# EAGLE schematic DeviceDIn24 (EAGLE 5.00)
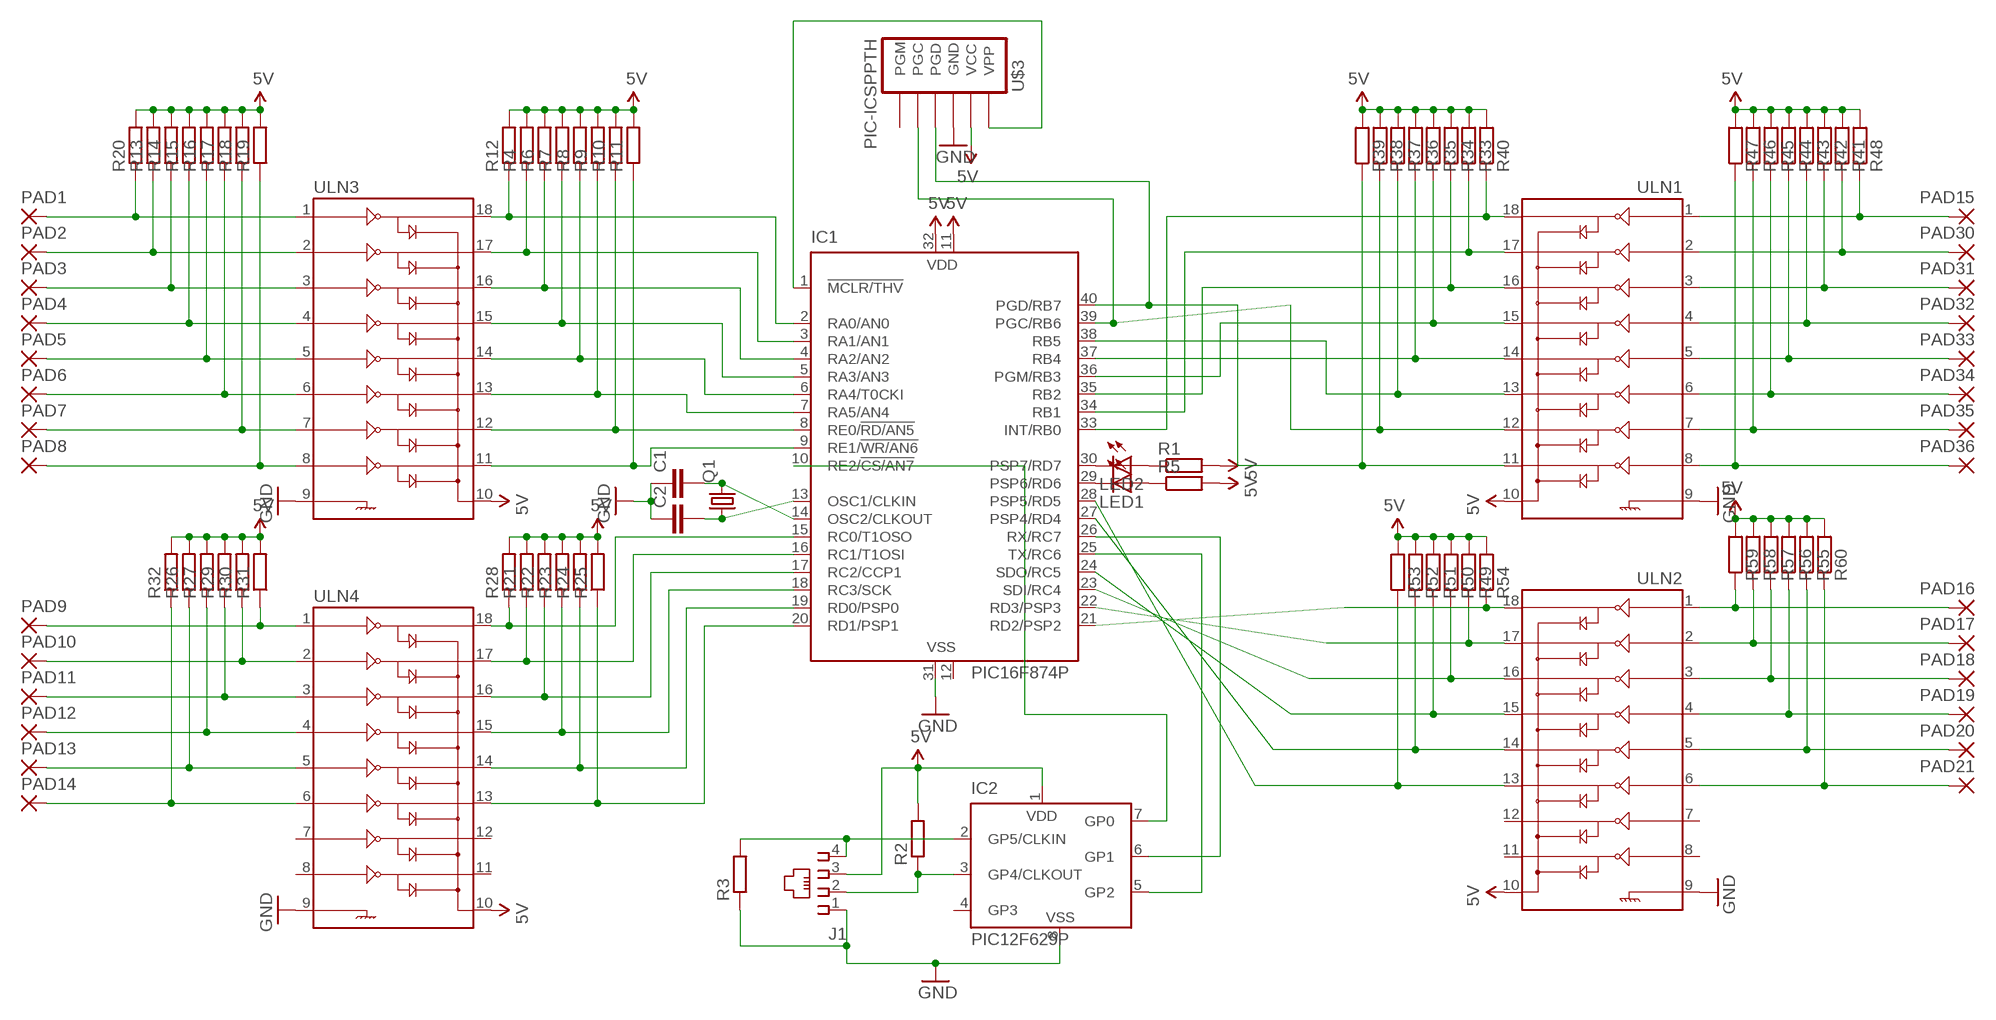
[diagram p0: schematic, sheet 1]

## Parts
C1  C2.5/2  [C2.5-2]
C2  C2.5/2  [C2.5-2]
IC1  PIC16F874P  [DIL40]
IC2  PIC12F629P  [DIL8]
J1  215876-6  [215876-6]
LED1  LED3MM  [LED3MM]
LED2  LED3MM  [LED3MM]
PAD1  2,15/1,0  [2,15/1,0]
PAD2  2,15/1,0  [2,15/1,0]
PAD3  2,15/1,0  [2,15/1,0]
PAD4  2,15/1,0  [2,15/1,0]
PAD5  2,15/1,0  [2,15/1,0]
PAD6  2,15/1,0  [2,15/1,0]
PAD7  2,15/1,0  [2,15/1,0]
PAD8  2,15/1,0  [2,15/1,0]
PAD9  2,15/1,0  [2,15/1,0]
PAD10  2,15/1,0  [2,15/1,0]
PAD11  2,15/1,0  [2,15/1,0]
PAD12  2,15/1,0  [2,15/1,0]
PAD13  2,15/1,0  [2,15/1,0]
PAD14  2,15/1,0  [2,15/1,0]
PAD15  2,15/1,0  [2,15/1,0]
PAD16  2,15/1,0  [2,15/1,0]
PAD17  2,15/1,0  [2,15/1,0]
PAD18  2,15/1,0  [2,15/1,0]
PAD19  2,15/1,0  [2,15/1,0]
PAD20  2,15/1,0  [2,15/1,0]
PAD21  2,15/1,0  [2,15/1,0]
PAD30  2,15/1,0  [2,15/1,0]
PAD31  2,15/1,0  [2,15/1,0]
PAD32  2,15/1,0  [2,15/1,0]
PAD33  2,15/1,0  [2,15/1,0]
PAD34  2,15/1,0  [2,15/1,0]
PAD35  2,15/1,0  [2,15/1,0]
PAD36  2,15/1,0  [2,15/1,0]
Q1  CRYSTALHC49U-H  [HC49U-H]
R1  R-EU_0204/2V  [0204V]
R2  R-EU_0204/5  [0204/5]
R3  R-EU_0204/5  [0204/5]
R4  R-EU_0204/5  [0204/5]
R5  R-EU_0204/2V  [0204V]
R6  R-EU_0204/7  [0204/7]
R7  R-EU_0207/10  [0207/10]
R8  R-EU_0207/10  [0207/10]
R9  R-EU_0204/7  [0204/7]
R10  R-EU_0204/5  [0204/5]
R11  R-EU_0204/5  [0204/5]
R12  R-EU_0204/5  [0204/5]
R13  R-EU_0204/5  [0204/5]
R14  R-EU_0204/7  [0204/7]
R15  R-EU_0207/10  [0207/10]
R16  R-EU_0207/10  [0207/10]
R17  R-EU_0204/7  [0204/7]
R18  R-EU_0204/5  [0204/5]
R19  R-EU_0204/5  [0204/5]
R20  R-EU_0204/5  [0204/5]
R21  R-EU_0204/5  [0204/5]
R22  R-EU_0204/7  [0204/7]
R23  R-EU_0204/7  [0204/7]
R24  R-EU_0204/5  [0204/5]
R25  R-EU_0204/5  [0204/5]
R26  R-EU_0204/5  [0204/5]
R27  R-EU_0204/7  [0204/7]
R28  R-EU_0204/5  [0204/5]
R29  R-EU_0204/7  [0204/7]
R30  R-EU_0204/5  [0204/5]
R31  R-EU_0204/5  [0204/5]
R32  R-EU_0204/5  [0204/5]
R33  R-EU_0204/5  [0204/5]
R34  R-EU_0204/7  [0204/7]
R35  R-EU_0207/10  [0207/10]
R36  R-EU_0207/10  [0207/10]
R37  R-EU_0204/7  [0204/7]
R38  R-EU_0204/5  [0204/5]
R39  R-EU_0204/5  [0204/5]
R40  R-EU_0204/5  [0204/5]
R41  R-EU_0204/5  [0204/5]
R42  R-EU_0204/7  [0204/7]
R43  R-EU_0207/10  [0207/10]
R44  R-EU_0207/10  [0207/10]
R45  R-EU_0204/7  [0204/7]
R46  R-EU_0204/5  [0204/5]
R47  R-EU_0204/5  [0204/5]
R48  R-EU_0204/5  [0204/5]
R49  R-EU_0204/5  [0204/5]
R50  R-EU_0204/7  [0204/7]
R51  R-EU_0204/7  [0204/7]
R52  R-EU_0204/5  [0204/5]
R53  R-EU_0204/5  [0204/5]
R54  R-EU_0204/5  [0204/5]
R55  R-EU_0204/5  [0204/5]
R56  R-EU_0204/7  [0204/7]
R57  R-EU_0204/7  [0204/7]
R58  R-EU_0204/5  [0204/5]
R59  R-EU_0204/5  [0204/5]
R60  R-EU_0204/5  [0204/5]
U$3  PIC-ICSPPTH  [MOLEX-1X6]
ULN1  ULN2803DIP  [DIL18]
ULN2  ULN2803DIP  [DIL18]
ULN3  ULN2803DIP  [DIL18]
ULN4  ULN2803DIP  [DIL18]

## Nets
5V: IC1.11(VDD) IC1.32(VDD) IC2.1(VDD) J1.3 R1.2 R2.2 R4.2 R5.2 R6.2 R7.2 R8.2 R9.2 R10.2 R11.2 R12.2 R13.2 R14.2 R15.2 R16.2 R17.2 R18.2 R19.2 R20.2 R21.2 R22.2 R23.2 R24.2 R25.2 R26.2 R27.2 R28.2 R29.2 R30.2 R31.2 R32.2 R33.2 R34.2 R35.2 R36.2 R37.2 R38.2 R39.2 R40.2 R41.2 R42.2 R43.2 R44.2 R45.2 R46.2 R47.2 R48.2 R49.2 R50.2 R51.2 R52.2 R53.2 R54.2 R55.2 R56.2 R57.2 R58.2 R59.2 R60.2 U$3.5(VCC) ULN1.10 ULN2.10 ULN3.10 ULN4.10
GND: C1.1 C2.1 IC1.31(VSS) IC2.8(VSS) J1.1 R3.1 U$3.4(GND) ULN1.9 ULN2.9 ULN3.9 ULN4.9
N$1: IC1.1(!MCLR/THV) U$3.6(VPP)
N$2: IC1.21(RD2/PSP2) R54.1 ULN2.18
N$3: IC1.2(RA0/AN0) R12.1 ULN3.18
N$4: IC1.3(RA1/AN1) R4.1 ULN3.17
N$6: C2.2 IC1.13(OSC1/CLKIN) Q1.1
N$7: IC1.26(RX/RC7) IC2.6(GP1)
N$8: IC1.4(RA2/AN2) R6.1 ULN3.16
N$9: IC1.5(RA3/AN3) R7.1 ULN3.15
N$10: IC1.22(RD3/PSP3) R49.1 ULN2.17
N$11: IC1.6(RA4/T0CKI) R8.1 ULN3.14
N$12: IC1.7(RA5/AN4) R9.1 ULN3.13
N$13: IC1.8(RE0/!RD/AN5) R10.1 ULN3.12
N$14: IC1.9(RE1/!WR/AN6) R11.1 ULN3.11
N$15: IC1.30(PSP7/RD7) LED2.K(C)
N$16: IC1.15(RC0/T1OSO) R28.1 ULN4.18
N$17: PAD1.1(P) R20.1 ULN3.1
N$18: PAD2.1(P) R13.1 ULN3.2
N$19: PAD3.1(P) R14.1 ULN3.3
N$20: PAD4.1(P) R15.1 ULN3.4
N$21: PAD5.1(P) R16.1 ULN3.5
N$22: PAD6.1(P) R17.1 ULN3.6
N$23: PAD7.1(P) R18.1 ULN3.7
N$24: PAD8.1(P) R19.1 ULN3.8
N$25: IC1.16(RC1/T1OSI) R21.1 ULN4.17
N$26: IC1.17(RC2/CCP1) R22.1 ULN4.16
N$27: IC1.18(RC3/SCK) R23.1 ULN4.15
N$28: IC1.19(RD0/PSP0) R24.1 ULN4.14
N$29: PAD9.1(P) R31.1 ULN4.1
N$30: IC1.20(RD1/PSP1) R25.1 ULN4.13
N$31: PAD10.1(P) R30.1 ULN4.2
N$32: PAD11.1(P) R29.1 ULN4.3
N$33: PAD12.1(P) R27.1 ULN4.4
N$34: LED2.A R1.1
N$35: LED1.A R5.1
N$36: PAD13.1(P) R26.1 ULN4.5
N$37: PAD14.1(P) R32.1 ULN4.6
N$38: C1.2 IC1.14(OSC2/CLKOUT) Q1.2
N$40: IC1.35(RB2) R34.1 ULN1.16
N$41: IC1.36(PGM/RB3) R35.1 ULN1.15
N$42: IC1.37(RB4) R36.1 ULN1.14
N$43: IC1.38(RB5) R37.1 ULN1.13
N$44: IC1.39(PGC/RB6) R38.1 U$3.2(PGC) ULN1.12
N$45: IC1.40(PGD/RB7) R39.1 U$3.3(PGD) ULN1.11
N$46: PAD15.1(P) R48.1 ULN1.1
N$47: PAD30.1(P) R41.1 ULN1.2
N$48: PAD31.1(P) R42.1 ULN1.3
N$49: PAD32.1(P) R43.1 ULN1.4
N$50: PAD33.1(P) R44.1 ULN1.5
N$51: PAD34.1(P) R45.1 ULN1.6
N$52: PAD35.1(P) R46.1 ULN1.7
N$53: PAD36.1(P) R47.1 ULN1.8
N$54: IC1.23(SDI/RC4) R50.1 ULN2.16
N$55: IC1.24(SDO/RC5) R51.1 ULN2.15
N$56: IC1.27(PSP4/RD4) R52.1 ULN2.14
N$57: IC1.28(PSP5/RD5) R53.1 ULN2.13
N$58: PAD16.1(P) R59.1 ULN2.1
N$59: PAD17.1(P) R58.1 ULN2.2
N$60: PAD18.1(P) R57.1 ULN2.3
N$61: PAD19.1(P) R56.1 ULN2.4
N$62: PAD20.1(P) R55.1 ULN2.5
N$63: PAD21.1(P) R60.1 ULN2.6
N$64: IC1.34(RB1) R33.1 ULN1.17
N$65: IC1.33(INT/RB0) R40.1 ULN1.18
N$67: IC1.29(PSP6/RD6) LED1.K(C)
N$68: IC2.3(GP4/CLKOUT) J1.2 R2.1
N$69: IC2.2(GP5/CLKIN) J1.4 R3.2
N$71: IC1.10(RE2/!CS/AN7) IC2.7(GP0)
N$73: IC1.25(TX/RC6) IC2.5(GP2)
Unconnected: IC2.4(GP3) U$3.1(PGM) ULN2.7 ULN2.8 ULN2.11 ULN2.12 ULN4.7 ULN4.8 ULN4.11 ULN4.12

## Power pins joined to a net without a drawn wire
VSS: IC1.12(VSS)

## Library data of the parts
C1 C2 = capacitor-wima:C: CAPACITOR naming: grid - package width
IC1 = microchip:PIC16F87*: MICROCONTROLLER
IC2 = microchip:PIC12F6*: Data Sheet 8-Pin FLASH-Based 8-Bit CMOS Microcontrollers Source: http://www.microchip.com .. 41190c.pdf
J1 = con-amp:215876-6: AMP connector
LED1 LED2 = led:LED: LED OSRAM: - CHIPLED LG R971, LG N971, LY N971, LG Q971, LY Q971, LO R971, LY R971 LH N974, LH R974 LS Q976, LO Q976, LY Q976 LO Q996 - Hyper CHIPLED LW Q18S LB Q993, LB Q99A, LB R99A - SideLED LS A670, LO A670, LY A670, LG A670, LP A670 LB A673, LV A673, LT A673, LW A673 LH A674 LY A675 LS A676, LA A676, LO A676, LY A676, LW A676 LS A679, LY A679, LG A679 - Hyper Micro SIDELED® LS Y876, LA Y876, LO Y876, LY Y876 LT Y87S - SmartLED LW L88C, LW L88S LB L89C, LB L89S, LG L890 LS L89K, LO L89K, LY L89K LS L896, LA L896, LO L896, LY L896 - TOPLED LS T670, LO T670, LY T670, LG T670, LP T670 LSG T670, LSP T670, LSY T670, LOP T670, LYG T670 LG T671, LOG T671, LSG T671 LB T673, LV T673, LT T673, LW T673 LH T674 LS T676, LA T676, LO T676, LY T676, LB T676, LH T676, LSB T676, LW T676 LB T67C, LV T67C, LT T67C, LS T67K, LO T67K, LY T67K, LW E67C LS E67B, LA E67B, LO E67B, LY E67B, LB E67C, LV E67C, LT E67C LW T67C LS T679, LY T679, LG T679 LS T770, LO T770, LY T770, LG T770, LP T770 LB T773, LV T773, LT T773, LW T773 LH T774 LS E675, LA E675, LY E675, LS T675 LS T776, LA T776, LO T776, LY T776, LB T776 LHGB T686 LT T68C, LB T68C - Hyper Mini TOPLED® LB M676 - Mini TOPLED Santana® LG M470 LS M47K, LO M47K, LY M47K Source: http://www.osram.convergy.de LUXEON: - LUMILED® LXK2-PW12-R00, LXK2-PW12-S00, LXK2-PW14-U00, LXK2-PW14-V00 LXK2-PM12-R00, LXK2-PM12-S00, LXK2-PM14-U00 LXK2-PE12-Q00, LXK2-PE12-R00, LXK2-PE12-S00, LXK2-PE14-T00, LXK2-PE14-U00 LXK2-PB12-K00, LXK2-PB12-L00, LXK2-PB12-M00, LXK2-PB14-N00, LXK2-PB14-P00, LXK2-PB14-Q00 LXK2-PR12-L00, LXK2-PR12-M00, LXK2-PR14-Q00, LXK2-PR14-R00 LXK2-PD12-Q00, LXK2-PD12-R00, LXK2-PD12-S00 LXK2-PH12-R00, LXK2-PH12-S00 LXK2-PL12-P00, LXK2-PL12-Q00, LXK2-PL12-R00 Source: www.luxeon.com KINGBRIGHT: KA-3528ASYC Source: www.kingbright.com
PAD1-PAD21 PAD30-PAD36 = wirepad:2,15/1,0: THROUGH-HOLE PAD
Q1 = crystal:CRYSTAL: CRYSTAL
R1-R60 = resistor:R-EU_: RESISTOR, European symbol
U$3 = SparkFun:PIC-ICSP: ISCP Programming connector for UAV, UBW Kit, etc.
ULN1-ULN4 = SparkFun:ULN2803: Darlington Driver ULN2803 Darlington array. 500mA max per channel, 8-channel package. Spark Fun Electronics SKU : COM-00312